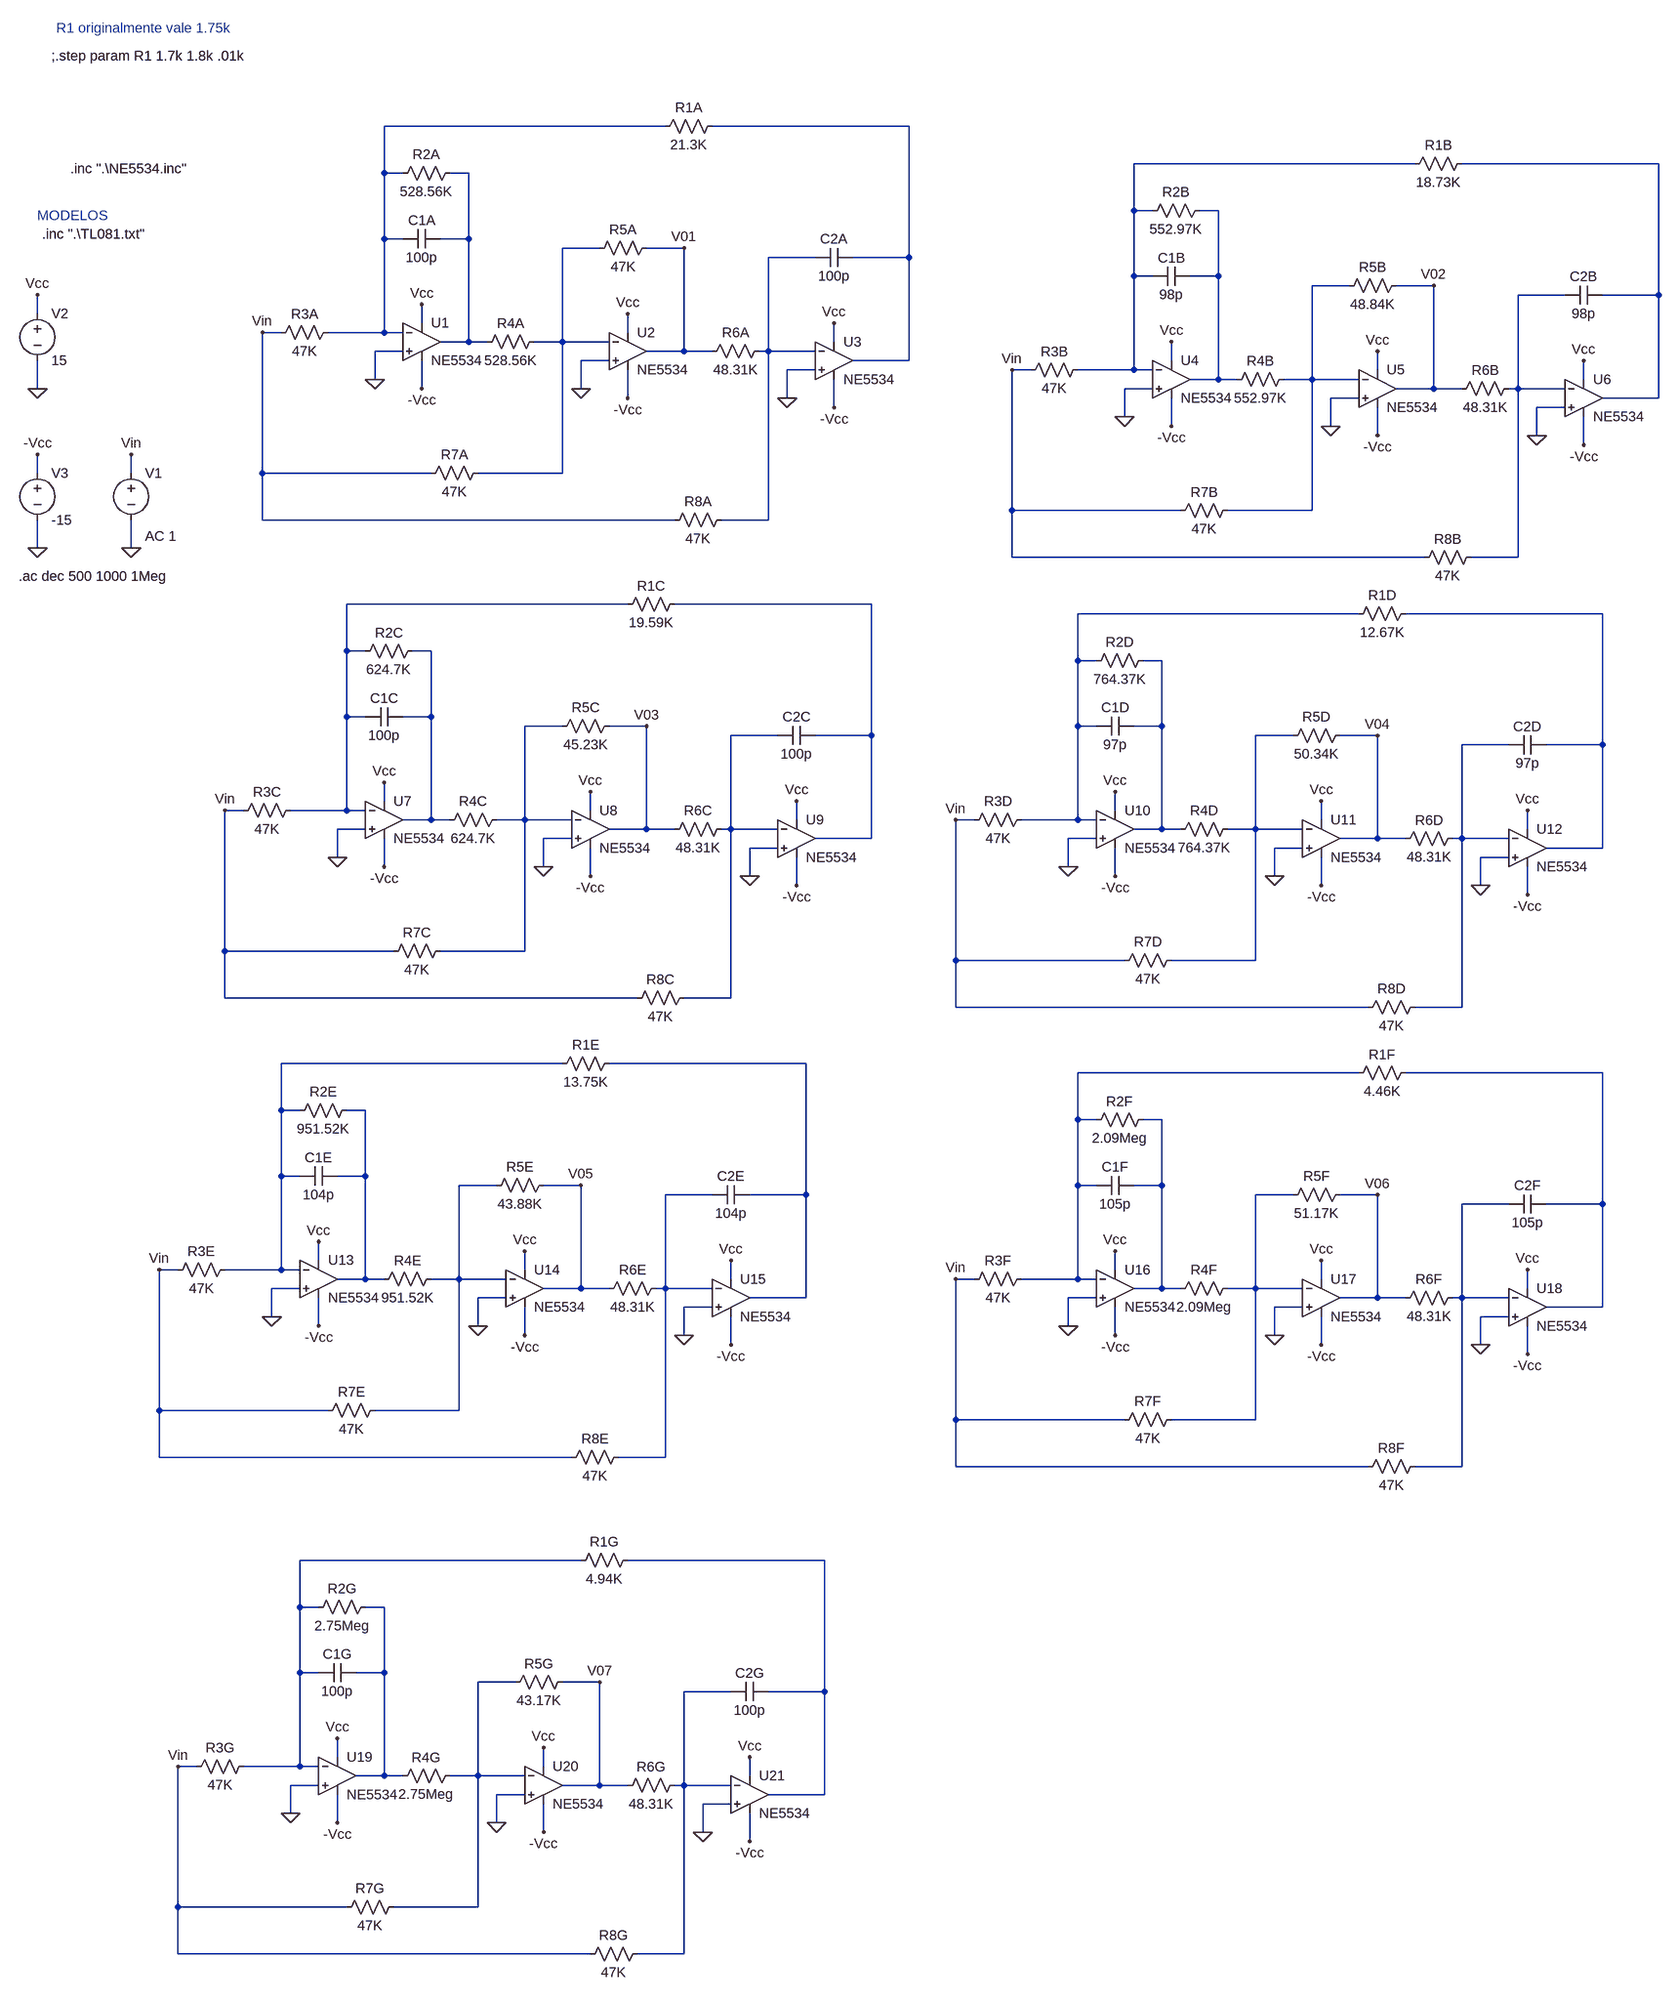
[diagram p0: schematic FT-TL081.asc]
FT-TL081.asc, the LTspice schematic file:
Version 4
SHEET 1 2736 2688
WIRE 800 -480 320 -480
WIRE 1216 -480 880 -480
WIRE 2080 -416 1600 -416
WIRE 2496 -416 2160 -416
WIRE 320 -400 320 -480
WIRE 352 -400 320 -400
WIRE 464 -400 432 -400
WIRE 1600 -336 1600 -416
WIRE 1632 -336 1600 -336
WIRE 1744 -336 1712 -336
WIRE 320 -288 320 -400
WIRE 352 -288 320 -288
WIRE 464 -288 464 -400
WIRE 464 -288 416 -288
WIRE 688 -272 624 -272
WIRE 832 -272 768 -272
WIRE 1056 -256 976 -256
WIRE 1216 -256 1216 -480
WIRE 1216 -256 1120 -256
WIRE 1600 -224 1600 -336
WIRE 1632 -224 1600 -224
WIRE 1744 -224 1744 -336
WIRE 1744 -224 1696 -224
WIRE 1968 -208 1904 -208
WIRE 2112 -208 2048 -208
WIRE 2336 -192 2256 -192
WIRE 2496 -192 2496 -416
WIRE 2496 -192 2400 -192
WIRE -272 -160 -272 -192
WIRE 384 -144 384 -176
WIRE 144 -128 112 -128
WIRE 320 -128 320 -288
WIRE 320 -128 224 -128
WIRE 352 -128 320 -128
WIRE 736 -128 736 -160
WIRE 464 -112 464 -288
WIRE 464 -112 416 -112
WIRE 496 -112 464 -112
WIRE 624 -112 624 -272
WIRE 624 -112 576 -112
WIRE 704 -112 624 -112
WIRE 1088 -112 1088 -144
WIRE 352 -96 304 -96
WIRE 832 -96 832 -272
WIRE 832 -96 768 -96
WIRE 880 -96 832 -96
WIRE 976 -96 976 -256
WIRE 976 -96 960 -96
WIRE 1056 -96 976 -96
WIRE 704 -80 656 -80
WIRE 1216 -80 1216 -256
WIRE 1216 -80 1120 -80
WIRE 1664 -80 1664 -112
WIRE 1056 -64 1008 -64
WIRE 1424 -64 1392 -64
WIRE 1600 -64 1600 -224
WIRE 1600 -64 1504 -64
WIRE 1632 -64 1600 -64
WIRE 2016 -64 2016 -96
WIRE 304 -48 304 -96
WIRE 1744 -48 1744 -224
WIRE 1744 -48 1696 -48
WIRE 1776 -48 1744 -48
WIRE 1904 -48 1904 -208
WIRE 1904 -48 1856 -48
WIRE 1984 -48 1904 -48
WIRE 2368 -48 2368 -80
WIRE -272 -32 -272 -80
WIRE 384 -32 384 -80
WIRE 656 -32 656 -80
WIRE 1632 -32 1584 -32
WIRE 2112 -32 2112 -208
WIRE 2112 -32 2048 -32
WIRE 2160 -32 2112 -32
WIRE 2256 -32 2256 -192
WIRE 2256 -32 2240 -32
WIRE 2336 -32 2256 -32
WIRE 736 -16 736 -64
WIRE 1008 -16 1008 -64
WIRE 1984 -16 1936 -16
WIRE 2496 -16 2496 -192
WIRE 2496 -16 2400 -16
WIRE 1088 0 1088 -48
WIRE 2336 0 2288 0
WIRE 1584 16 1584 -32
WIRE 1664 32 1664 -16
WIRE 1936 32 1936 -16
WIRE 2016 48 2016 0
WIRE 2288 48 2288 0
WIRE 2368 64 2368 16
WIRE -272 112 -272 80
WIRE -112 112 -112 80
WIRE 112 112 112 -128
WIRE 400 112 112 112
WIRE 624 112 624 -112
WIRE 624 112 480 112
WIRE 1392 176 1392 -64
WIRE 1680 176 1392 176
WIRE 1904 176 1904 -48
WIRE 1904 176 1760 176
WIRE 112 192 112 112
WIRE 816 192 112 192
WIRE 976 192 976 -96
WIRE 976 192 896 192
WIRE -272 240 -272 192
WIRE -112 240 -112 192
WIRE 1392 256 1392 176
WIRE 2096 256 1392 256
WIRE 2256 256 2256 -32
WIRE 2256 256 2176 256
WIRE 736 336 256 336
WIRE 1152 336 816 336
WIRE 1984 352 1504 352
WIRE 2400 352 2064 352
WIRE 256 416 256 336
WIRE 288 416 256 416
WIRE 400 416 368 416
WIRE 1504 432 1504 352
WIRE 1536 432 1504 432
WIRE 1648 432 1616 432
WIRE 256 528 256 416
WIRE 288 528 256 528
WIRE 400 528 400 416
WIRE 400 528 352 528
WIRE 624 544 560 544
WIRE 768 544 704 544
WIRE 1504 544 1504 432
WIRE 1536 544 1504 544
WIRE 1648 544 1648 432
WIRE 1648 544 1600 544
WIRE 992 560 912 560
WIRE 1152 560 1152 336
WIRE 1152 560 1056 560
WIRE 1872 560 1808 560
WIRE 2016 560 1952 560
WIRE 2240 576 2160 576
WIRE 2400 576 2400 352
WIRE 2400 576 2304 576
WIRE 320 672 320 640
WIRE 80 688 48 688
WIRE 256 688 256 528
WIRE 256 688 160 688
WIRE 288 688 256 688
WIRE 672 688 672 656
WIRE 1568 688 1568 656
WIRE 400 704 400 528
WIRE 400 704 352 704
WIRE 432 704 400 704
WIRE 560 704 560 544
WIRE 560 704 512 704
WIRE 640 704 560 704
WIRE 1024 704 1024 672
WIRE 1328 704 1296 704
WIRE 1504 704 1504 544
WIRE 1504 704 1408 704
WIRE 1536 704 1504 704
WIRE 1920 704 1920 672
WIRE 288 720 240 720
WIRE 768 720 768 544
WIRE 768 720 704 720
WIRE 816 720 768 720
WIRE 912 720 912 560
WIRE 912 720 896 720
WIRE 992 720 912 720
WIRE 1648 720 1648 544
WIRE 1648 720 1600 720
WIRE 1680 720 1648 720
WIRE 1808 720 1808 560
WIRE 1808 720 1760 720
WIRE 1888 720 1808 720
WIRE 2272 720 2272 688
WIRE 640 736 592 736
WIRE 1152 736 1152 560
WIRE 1152 736 1056 736
WIRE 1536 736 1488 736
WIRE 2016 736 2016 560
WIRE 2016 736 1952 736
WIRE 2064 736 2016 736
WIRE 2160 736 2160 576
WIRE 2160 736 2144 736
WIRE 2240 736 2160 736
WIRE 992 752 944 752
WIRE 1888 752 1840 752
WIRE 2400 752 2400 576
WIRE 2400 752 2304 752
WIRE 240 768 240 720
WIRE 2240 768 2192 768
WIRE 320 784 320 736
WIRE 592 784 592 736
WIRE 1488 784 1488 736
WIRE 672 800 672 752
WIRE 944 800 944 752
WIRE 1568 800 1568 752
WIRE 1840 800 1840 752
WIRE 1024 816 1024 768
WIRE 1920 816 1920 768
WIRE 2192 816 2192 768
WIRE 2272 832 2272 784
WIRE 48 928 48 688
WIRE 336 928 48 928
WIRE 560 928 560 704
WIRE 560 928 416 928
WIRE 1296 944 1296 704
WIRE 1584 944 1296 944
WIRE 1808 944 1808 720
WIRE 1808 944 1664 944
WIRE 48 1008 48 928
WIRE 752 1008 48 1008
WIRE 912 1008 912 720
WIRE 912 1008 832 1008
WIRE 1296 1024 1296 944
WIRE 2000 1024 1296 1024
WIRE 2160 1024 2160 736
WIRE 2160 1024 2080 1024
WIRE 624 1120 144 1120
WIRE 1040 1120 704 1120
WIRE 1984 1136 1504 1136
WIRE 2400 1136 2064 1136
WIRE 144 1200 144 1120
WIRE 176 1200 144 1200
WIRE 288 1200 256 1200
WIRE 1504 1216 1504 1136
WIRE 1536 1216 1504 1216
WIRE 1648 1216 1616 1216
WIRE 144 1312 144 1200
WIRE 176 1312 144 1312
WIRE 288 1312 288 1200
WIRE 288 1312 240 1312
WIRE 512 1328 448 1328
WIRE 656 1328 592 1328
WIRE 1504 1328 1504 1216
WIRE 1536 1328 1504 1328
WIRE 1648 1328 1648 1216
WIRE 1648 1328 1600 1328
WIRE 880 1344 800 1344
WIRE 1040 1344 1040 1120
WIRE 1040 1344 944 1344
WIRE 1872 1344 1808 1344
WIRE 2016 1344 1952 1344
WIRE 2240 1360 2160 1360
WIRE 2400 1360 2400 1136
WIRE 2400 1360 2304 1360
WIRE 208 1456 208 1424
WIRE -32 1472 -64 1472
WIRE 144 1472 144 1312
WIRE 144 1472 48 1472
WIRE 176 1472 144 1472
WIRE 560 1472 560 1440
WIRE 1568 1472 1568 1440
WIRE 288 1488 288 1312
WIRE 288 1488 240 1488
WIRE 320 1488 288 1488
WIRE 448 1488 448 1328
WIRE 448 1488 400 1488
WIRE 528 1488 448 1488
WIRE 912 1488 912 1456
WIRE 1328 1488 1296 1488
WIRE 1504 1488 1504 1328
WIRE 1504 1488 1408 1488
WIRE 1536 1488 1504 1488
WIRE 1920 1488 1920 1456
WIRE 176 1504 128 1504
WIRE 656 1504 656 1328
WIRE 656 1504 592 1504
WIRE 704 1504 656 1504
WIRE 800 1504 800 1344
WIRE 800 1504 784 1504
WIRE 880 1504 800 1504
WIRE 1648 1504 1648 1328
WIRE 1648 1504 1600 1504
WIRE 1680 1504 1648 1504
WIRE 1808 1504 1808 1344
WIRE 1808 1504 1760 1504
WIRE 1888 1504 1808 1504
WIRE 2272 1504 2272 1472
WIRE 528 1520 480 1520
WIRE 1040 1520 1040 1344
WIRE 1040 1520 944 1520
WIRE 1536 1520 1488 1520
WIRE 2016 1520 2016 1344
WIRE 2016 1520 1952 1520
WIRE 2064 1520 2016 1520
WIRE 2160 1520 2160 1360
WIRE 2160 1520 2144 1520
WIRE 2240 1520 2160 1520
WIRE 880 1536 832 1536
WIRE 1888 1536 1840 1536
WIRE 2400 1536 2400 1360
WIRE 2400 1536 2304 1536
WIRE 128 1552 128 1504
WIRE 2240 1552 2192 1552
WIRE 208 1568 208 1520
WIRE 480 1568 480 1520
WIRE 1488 1568 1488 1520
WIRE 560 1584 560 1536
WIRE 832 1584 832 1536
WIRE 1568 1584 1568 1536
WIRE 1840 1584 1840 1536
WIRE 912 1600 912 1552
WIRE 1920 1600 1920 1552
WIRE 2192 1600 2192 1552
WIRE 2272 1616 2272 1568
WIRE -64 1712 -64 1472
WIRE 224 1712 -64 1712
WIRE 448 1712 448 1488
WIRE 448 1712 304 1712
WIRE 1296 1728 1296 1488
WIRE 1584 1728 1296 1728
WIRE 1808 1728 1808 1504
WIRE 1808 1728 1664 1728
WIRE -64 1792 -64 1712
WIRE 640 1792 -64 1792
WIRE 800 1792 800 1504
WIRE 800 1792 720 1792
WIRE 1296 1808 1296 1728
WIRE 2000 1808 1296 1808
WIRE 2160 1808 2160 1520
WIRE 2160 1808 2080 1808
WIRE 656 1968 176 1968
WIRE 1072 1968 736 1968
WIRE 176 2048 176 1968
WIRE 208 2048 176 2048
WIRE 320 2048 288 2048
WIRE 176 2160 176 2048
WIRE 208 2160 176 2160
WIRE 320 2160 320 2048
WIRE 320 2160 272 2160
WIRE 544 2176 480 2176
WIRE 688 2176 624 2176
WIRE 912 2192 832 2192
WIRE 1072 2192 1072 1968
WIRE 1072 2192 976 2192
WIRE 240 2304 240 2272
WIRE 0 2320 -32 2320
WIRE 176 2320 176 2160
WIRE 176 2320 80 2320
WIRE 208 2320 176 2320
WIRE 592 2320 592 2288
WIRE 320 2336 320 2160
WIRE 320 2336 272 2336
WIRE 352 2336 320 2336
WIRE 480 2336 480 2176
WIRE 480 2336 432 2336
WIRE 560 2336 480 2336
WIRE 944 2336 944 2304
WIRE 208 2352 160 2352
WIRE 688 2352 688 2176
WIRE 688 2352 624 2352
WIRE 736 2352 688 2352
WIRE 832 2352 832 2192
WIRE 832 2352 816 2352
WIRE 912 2352 832 2352
WIRE 560 2368 512 2368
WIRE 1072 2368 1072 2192
WIRE 1072 2368 976 2368
WIRE 912 2384 864 2384
WIRE 160 2400 160 2352
WIRE 240 2416 240 2368
WIRE 512 2416 512 2368
WIRE 592 2432 592 2384
WIRE 864 2432 864 2384
WIRE 944 2448 944 2400
WIRE -32 2560 -32 2320
WIRE 256 2560 -32 2560
WIRE 480 2560 480 2336
WIRE 480 2560 336 2560
WIRE -32 2640 -32 2560
WIRE 672 2640 -32 2640
WIRE 832 2640 832 2352
WIRE 832 2640 752 2640
FLAG -272 80 -Vcc
FLAG -272 -192 Vcc
FLAG -272 -32 0
FLAG -272 240 0
FLAG 384 -176 Vcc
FLAG 384 -32 -Vcc
FLAG 304 -48 0
FLAG 736 -160 Vcc
FLAG 736 -16 -Vcc
FLAG 656 -32 0
FLAG 1088 -144 Vcc
FLAG 1088 0 -Vcc
FLAG 1008 -16 0
FLAG -112 240 0
FLAG -112 80 Vin
FLAG 112 -128 Vin
FLAG 832 -272 V01
FLAG 1664 -112 Vcc
FLAG 1664 32 -Vcc
FLAG 1584 16 0
FLAG 2016 -96 Vcc
FLAG 2016 48 -Vcc
FLAG 1936 32 0
FLAG 2368 -80 Vcc
FLAG 2368 64 -Vcc
FLAG 2288 48 0
FLAG 1392 -64 Vin
FLAG 2112 -208 V02
FLAG 320 640 Vcc
FLAG 320 784 -Vcc
FLAG 240 768 0
FLAG 672 656 Vcc
FLAG 672 800 -Vcc
FLAG 592 784 0
FLAG 1024 672 Vcc
FLAG 1024 816 -Vcc
FLAG 944 800 0
FLAG 48 688 Vin
FLAG 768 544 V03
FLAG 1568 656 Vcc
FLAG 1568 800 -Vcc
FLAG 1488 784 0
FLAG 1920 672 Vcc
FLAG 1920 816 -Vcc
FLAG 1840 800 0
FLAG 2272 688 Vcc
FLAG 2272 832 -Vcc
FLAG 2192 816 0
FLAG 1296 704 Vin
FLAG 2016 560 V04
FLAG 208 1424 Vcc
FLAG 208 1568 -Vcc
FLAG 128 1552 0
FLAG 560 1440 Vcc
FLAG 560 1584 -Vcc
FLAG 480 1568 0
FLAG 912 1456 Vcc
FLAG 912 1600 -Vcc
FLAG 832 1584 0
FLAG -64 1472 Vin
FLAG 656 1328 V05
FLAG 1568 1440 Vcc
FLAG 1568 1584 -Vcc
FLAG 1488 1568 0
FLAG 1920 1456 Vcc
FLAG 1920 1600 -Vcc
FLAG 1840 1584 0
FLAG 2272 1472 Vcc
FLAG 2272 1616 -Vcc
FLAG 2192 1600 0
FLAG 1296 1488 Vin
FLAG 2016 1344 V06
FLAG 240 2272 Vcc
FLAG 240 2416 -Vcc
FLAG 160 2400 0
FLAG 592 2288 Vcc
FLAG 592 2432 -Vcc
FLAG 512 2416 0
FLAG 944 2304 Vcc
FLAG 944 2448 -Vcc
FLAG 864 2432 0
FLAG -32 2320 Vin
FLAG 688 2176 V07
SYMBOL voltage -272 -176 R0
SYMATTR InstName V2
SYMATTR Value 15
SYMBOL voltage -272 96 R0
SYMATTR InstName V3
SYMATTR Value -15
SYMBOL Opamps\\opamp2 384 -176 R0
SYMATTR InstName U1
SYMATTR Value NE5534
SYMBOL cap 416 -304 R90
WINDOW 0 0 32 VBottom 2
WINDOW 3 32 32 VTop 2
SYMATTR InstName C1A
SYMATTR Value 100p
SYMBOL res 896 -496 R90
WINDOW 0 0 56 VBottom 2
WINDOW 3 32 56 VTop 2
SYMATTR InstName R1A
SYMATTR Value 21.3K
SYMBOL res 448 -416 R90
WINDOW 0 0 56 VBottom 2
WINDOW 3 32 56 VTop 2
SYMATTR InstName R2A
SYMATTR Value 528.56K
SYMBOL res 240 -144 R90
WINDOW 0 0 56 VBottom 2
WINDOW 3 32 56 VTop 2
SYMATTR InstName R3A
SYMATTR Value 47K
SYMBOL res 592 -128 R90
WINDOW 0 0 56 VBottom 2
WINDOW 3 32 56 VTop 2
SYMATTR InstName R4A
SYMATTR Value 528.56K
SYMBOL res 784 -288 R90
WINDOW 0 0 56 VBottom 2
WINDOW 3 32 56 VTop 2
SYMATTR InstName R5A
SYMATTR Value 47K
SYMBOL res 976 -112 R90
WINDOW 0 0 56 VBottom 2
WINDOW 3 32 56 VTop 2
SYMATTR InstName R6A
SYMATTR Value 48.31K
SYMBOL res 496 96 R90
WINDOW 0 0 56 VBottom 2
WINDOW 3 32 56 VTop 2
SYMATTR InstName R7A
SYMATTR Value 47K
SYMBOL res 912 176 R90
WINDOW 0 0 56 VBottom 2
WINDOW 3 32 56 VTop 2
SYMATTR InstName R8A
SYMATTR Value 47K
SYMBOL cap 1120 -272 R90
WINDOW 0 0 32 VBottom 2
WINDOW 3 32 32 VTop 2
SYMATTR InstName C2A
SYMATTR Value 100p
SYMBOL voltage -112 96 R0
WINDOW 123 24 124 Left 2
WINDOW 39 0 0 Left 0
SYMATTR Value2 AC 1
SYMATTR InstName V1
SYMATTR Value ""
SYMBOL Opamps\\opamp2 736 -160 R0
SYMATTR InstName U2
SYMATTR Value NE5534
SYMBOL Opamps\\opamp2 1088 -144 R0
SYMATTR InstName U3
SYMATTR Value NE5534
SYMBOL Opamps\\opamp2 1664 -112 R0
SYMATTR InstName U4
SYMATTR Value NE5534
SYMBOL cap 1696 -240 R90
WINDOW 0 0 32 VBottom 2
WINDOW 3 32 32 VTop 2
SYMATTR InstName C1B
SYMATTR Value 98p
SYMBOL res 2176 -432 R90
WINDOW 0 0 56 VBottom 2
WINDOW 3 32 56 VTop 2
SYMATTR InstName R1B
SYMATTR Value 18.73K
SYMBOL res 1728 -352 R90
WINDOW 0 0 56 VBottom 2
WINDOW 3 32 56 VTop 2
SYMATTR InstName R2B
SYMATTR Value 552.97K
SYMBOL res 1520 -80 R90
WINDOW 0 0 56 VBottom 2
WINDOW 3 32 56 VTop 2
SYMATTR InstName R3B
SYMATTR Value 47K
SYMBOL res 1872 -64 R90
WINDOW 0 0 56 VBottom 2
WINDOW 3 32 56 VTop 2
SYMATTR InstName R4B
SYMATTR Value 552.97K
SYMBOL res 2064 -224 R90
WINDOW 0 0 56 VBottom 2
WINDOW 3 32 56 VTop 2
SYMATTR InstName R5B
SYMATTR Value 48.84K
SYMBOL res 2256 -48 R90
WINDOW 0 0 56 VBottom 2
WINDOW 3 32 56 VTop 2
SYMATTR InstName R6B
SYMATTR Value 48.31K
SYMBOL res 1776 160 R90
WINDOW 0 0 56 VBottom 2
WINDOW 3 32 56 VTop 2
SYMATTR InstName R7B
SYMATTR Value 47K
SYMBOL res 2192 240 R90
WINDOW 0 0 56 VBottom 2
WINDOW 3 32 56 VTop 2
SYMATTR InstName R8B
SYMATTR Value 47K
SYMBOL cap 2400 -208 R90
WINDOW 0 0 32 VBottom 2
WINDOW 3 32 32 VTop 2
SYMATTR InstName C2B
SYMATTR Value 98p
SYMBOL Opamps\\opamp2 2016 -96 R0
SYMATTR InstName U5
SYMATTR Value NE5534
SYMBOL Opamps\\opamp2 2368 -80 R0
SYMATTR InstName U6
SYMATTR Value NE5534
SYMBOL Opamps\\opamp2 320 640 R0
SYMATTR InstName U7
SYMATTR Value NE5534
SYMBOL cap 352 512 R90
WINDOW 0 0 32 VBottom 2
WINDOW 3 32 32 VTop 2
SYMATTR InstName C1C
SYMATTR Value 100p
SYMBOL res 832 320 R90
WINDOW 0 0 56 VBottom 2
WINDOW 3 32 56 VTop 2
SYMATTR InstName R1C
SYMATTR Value 19.59K
SYMBOL res 384 400 R90
WINDOW 0 0 56 VBottom 2
WINDOW 3 32 56 VTop 2
SYMATTR InstName R2C
SYMATTR Value 624.7K
SYMBOL res 176 672 R90
WINDOW 0 0 56 VBottom 2
WINDOW 3 32 56 VTop 2
SYMATTR InstName R3C
SYMATTR Value 47K
SYMBOL res 528 688 R90
WINDOW 0 0 56 VBottom 2
WINDOW 3 32 56 VTop 2
SYMATTR InstName R4C
SYMATTR Value 624.7K
SYMBOL res 720 528 R90
WINDOW 0 0 56 VBottom 2
WINDOW 3 32 56 VTop 2
SYMATTR InstName R5C
SYMATTR Value 45.23K
SYMBOL res 912 704 R90
WINDOW 0 0 56 VBottom 2
WINDOW 3 32 56 VTop 2
SYMATTR InstName R6C
SYMATTR Value 48.31K
SYMBOL res 432 912 R90
WINDOW 0 0 56 VBottom 2
WINDOW 3 32 56 VTop 2
SYMATTR InstName R7C
SYMATTR Value 47K
SYMBOL res 848 992 R90
WINDOW 0 0 56 VBottom 2
WINDOW 3 32 56 VTop 2
SYMATTR InstName R8C
SYMATTR Value 47K
SYMBOL cap 1056 544 R90
WINDOW 0 0 32 VBottom 2
WINDOW 3 32 32 VTop 2
SYMATTR InstName C2C
SYMATTR Value 100p
SYMBOL Opamps\\opamp2 672 656 R0
SYMATTR InstName U8
SYMATTR Value NE5534
SYMBOL Opamps\\opamp2 1024 672 R0
SYMATTR InstName U9
SYMATTR Value NE5534
SYMBOL Opamps\\opamp2 1568 656 R0
SYMATTR InstName U10
SYMATTR Value NE5534
SYMBOL cap 1600 528 R90
WINDOW 0 0 32 VBottom 2
WINDOW 3 32 32 VTop 2
SYMATTR InstName C1D
SYMATTR Value 97p
SYMBOL res 2080 336 R90
WINDOW 0 0 56 VBottom 2
WINDOW 3 32 56 VTop 2
SYMATTR InstName R1D
SYMATTR Value 12.67K
SYMBOL res 1632 416 R90
WINDOW 0 0 56 VBottom 2
WINDOW 3 32 56 VTop 2
SYMATTR InstName R2D
SYMATTR Value 764.37K
SYMBOL res 1424 688 R90
WINDOW 0 0 56 VBottom 2
WINDOW 3 32 56 VTop 2
SYMATTR InstName R3D
SYMATTR Value 47K
SYMBOL res 1776 704 R90
WINDOW 0 0 56 VBottom 2
WINDOW 3 32 56 VTop 2
SYMATTR InstName R4D
SYMATTR Value 764.37K
SYMBOL res 1968 544 R90
WINDOW 0 0 56 VBottom 2
WINDOW 3 32 56 VTop 2
SYMATTR InstName R5D
SYMATTR Value 50.34K
SYMBOL res 2160 720 R90
WINDOW 0 0 56 VBottom 2
WINDOW 3 32 56 VTop 2
SYMATTR InstName R6D
SYMATTR Value 48.31K
SYMBOL res 1680 928 R90
WINDOW 0 0 56 VBottom 2
WINDOW 3 32 56 VTop 2
SYMATTR InstName R7D
SYMATTR Value 47K
SYMBOL res 2096 1008 R90
WINDOW 0 0 56 VBottom 2
WINDOW 3 32 56 VTop 2
SYMATTR InstName R8D
SYMATTR Value 47K
SYMBOL cap 2304 560 R90
WINDOW 0 0 32 VBottom 2
WINDOW 3 32 32 VTop 2
SYMATTR InstName C2D
SYMATTR Value 97p
SYMBOL Opamps\\opamp2 1920 672 R0
SYMATTR InstName U11
SYMATTR Value NE5534
SYMBOL Opamps\\opamp2 2272 688 R0
SYMATTR InstName U12
SYMATTR Value NE5534
SYMBOL Opamps\\opamp2 208 1424 R0
SYMATTR InstName U13
SYMATTR Value NE5534
SYMBOL cap 240 1296 R90
WINDOW 0 0 32 VBottom 2
WINDOW 3 32 32 VTop 2
SYMATTR InstName C1E
SYMATTR Value 104p
SYMBOL res 720 1104 R90
WINDOW 0 0 56 VBottom 2
WINDOW 3 32 56 VTop 2
SYMATTR InstName R1E
SYMATTR Value 13.75K
SYMBOL res 272 1184 R90
WINDOW 0 0 56 VBottom 2
WINDOW 3 32 56 VTop 2
SYMATTR InstName R2E
SYMATTR Value 951.52K
SYMBOL res 64 1456 R90
WINDOW 0 0 56 VBottom 2
WINDOW 3 32 56 VTop 2
SYMATTR InstName R3E
SYMATTR Value 47K
SYMBOL res 416 1472 R90
WINDOW 0 0 56 VBottom 2
WINDOW 3 32 56 VTop 2
SYMATTR InstName R4E
SYMATTR Value 951.52K
SYMBOL res 608 1312 R90
WINDOW 0 0 56 VBottom 2
WINDOW 3 32 56 VTop 2
SYMATTR InstName R5E
SYMATTR Value 43.88K
SYMBOL res 800 1488 R90
WINDOW 0 0 56 VBottom 2
WINDOW 3 32 56 VTop 2
SYMATTR InstName R6E
SYMATTR Value 48.31K
SYMBOL res 320 1696 R90
WINDOW 0 0 56 VBottom 2
WINDOW 3 32 56 VTop 2
SYMATTR InstName R7E
SYMATTR Value 47K
SYMBOL res 736 1776 R90
WINDOW 0 0 56 VBottom 2
WINDOW 3 32 56 VTop 2
SYMATTR InstName R8E
SYMATTR Value 47K
SYMBOL cap 944 1328 R90
WINDOW 0 0 32 VBottom 2
WINDOW 3 32 32 VTop 2
SYMATTR InstName C2E
SYMATTR Value 104p
SYMBOL Opamps\\opamp2 560 1440 R0
SYMATTR InstName U14
SYMATTR Value NE5534
SYMBOL Opamps\\opamp2 912 1456 R0
SYMATTR InstName U15
SYMATTR Value NE5534
SYMBOL Opamps\\opamp2 1568 1440 R0
SYMATTR InstName U16
SYMATTR Value NE5534
SYMBOL cap 1600 1312 R90
WINDOW 0 0 32 VBottom 2
WINDOW 3 32 32 VTop 2
SYMATTR InstName C1F
SYMATTR Value 105p
SYMBOL res 2080 1120 R90
WINDOW 0 0 56 VBottom 2
WINDOW 3 32 56 VTop 2
SYMATTR InstName R1F
SYMATTR Value 4.46K
SYMBOL res 1632 1200 R90
WINDOW 0 0 56 VBottom 2
WINDOW 3 32 56 VTop 2
SYMATTR InstName R2F
SYMATTR Value 2.09Meg
SYMBOL res 1424 1472 R90
WINDOW 0 0 56 VBottom 2
WINDOW 3 32 56 VTop 2
SYMATTR InstName R3F
SYMATTR Value 47K
SYMBOL res 1776 1488 R90
WINDOW 0 0 56 VBottom 2
WINDOW 3 32 56 VTop 2
SYMATTR InstName R4F
SYMATTR Value 2.09Meg
SYMBOL res 1968 1328 R90
WINDOW 0 0 56 VBottom 2
WINDOW 3 32 56 VTop 2
SYMATTR InstName R5F
SYMATTR Value 51.17K
SYMBOL res 2160 1504 R90
WINDOW 0 0 56 VBottom 2
WINDOW 3 32 56 VTop 2
SYMATTR InstName R6F
SYMATTR Value 48.31K
SYMBOL res 1680 1712 R90
WINDOW 0 0 56 VBottom 2
WINDOW 3 32 56 VTop 2
SYMATTR InstName R7F
SYMATTR Value 47K
SYMBOL res 2096 1792 R90
WINDOW 0 0 56 VBottom 2
WINDOW 3 32 56 VTop 2
SYMATTR InstName R8F
SYMATTR Value 47K
SYMBOL cap 2304 1344 R90
WINDOW 0 0 32 VBottom 2
WINDOW 3 32 32 VTop 2
SYMATTR InstName C2F
SYMATTR Value 105p
SYMBOL Opamps\\opamp2 1920 1456 R0
SYMATTR InstName U17
SYMATTR Value NE5534
SYMBOL Opamps\\opamp2 2272 1472 R0
SYMATTR InstName U18
SYMATTR Value NE5534
SYMBOL Opamps\\opamp2 240 2272 R0
SYMATTR InstName U19
SYMATTR Value NE5534
SYMBOL cap 272 2144 R90
WINDOW 0 0 32 VBottom 2
WINDOW 3 32 32 VTop 2
SYMATTR InstName C1G
SYMATTR Value 100p
SYMBOL res 752 1952 R90
WINDOW 0 0 56 VBottom 2
WINDOW 3 32 56 VTop 2
SYMATTR InstName R1G
SYMATTR Value 4.94K
SYMBOL res 304 2032 R90
WINDOW 0 0 56 VBottom 2
WINDOW 3 32 56 VTop 2
SYMATTR InstName R2G
SYMATTR Value 2.75Meg
SYMBOL res 96 2304 R90
WINDOW 0 0 56 VBottom 2
WINDOW 3 32 56 VTop 2
SYMATTR InstName R3G
SYMATTR Value 47K
SYMBOL res 448 2320 R90
WINDOW 0 0 56 VBottom 2
WINDOW 3 32 56 VTop 2
SYMATTR InstName R4G
SYMATTR Value 2.75Meg
SYMBOL res 640 2160 R90
WINDOW 0 0 56 VBottom 2
WINDOW 3 32 56 VTop 2
SYMATTR InstName R5G
SYMATTR Value 43.17K
SYMBOL res 832 2336 R90
WINDOW 0 0 56 VBottom 2
WINDOW 3 32 56 VTop 2
SYMATTR InstName R6G
SYMATTR Value 48.31K
SYMBOL res 352 2544 R90
WINDOW 0 0 56 VBottom 2
WINDOW 3 32 56 VTop 2
SYMATTR InstName R7G
SYMATTR Value 47K
SYMBOL res 768 2624 R90
WINDOW 0 0 56 VBottom 2
WINDOW 3 32 56 VTop 2
SYMATTR InstName R8G
SYMATTR Value 47K
SYMBOL cap 976 2176 R90
WINDOW 0 0 32 VBottom 2
WINDOW 3 32 32 VTop 2
SYMATTR InstName C2G
SYMATTR Value 100p
SYMBOL Opamps\\opamp2 592 2288 R0
SYMATTR InstName U20
SYMATTR Value NE5534
SYMBOL Opamps\\opamp2 944 2304 R0
SYMATTR InstName U21
SYMATTR Value NE5534
TEXT -264 -296 Left 2 !.inc ".\\TL081.txt"
TEXT -272 -328 Left 2 ;MODELOS
TEXT -248 -600 Left 2 !;.step param R1 1.7k 1.8k .01k
TEXT -240 -648 Left 2 ;R1 originalmente vale 1.75k
TEXT -304 288 Left 2 !.ac dec 500 1000 1Meg
TEXT -216 -408 Left 2 !.inc ".\\NE5534.inc"

The netlist it stands for:
* FT-TL081.asc
V2 Vcc 0 15
V3 -Vcc 0 -15
XU1 0 N001 Vcc -Vcc N005 NE5534  ; pins In+ In- V+ V- OUT
C1A N005 N001 100p
R1A N002 N001 21.3K
R2A N005 N001 528.56K
R3A N001 Vin 47K
R4A N007 N005 528.56K
R5A V01 N007 47K
R6A N008 V01 48.31K
R7A N007 Vin 47K
R8A N008 Vin 47K
C2A N002 N008 100p
V1 Vin 0 AC 1
XU2 0 N007 Vcc -Vcc V01 NE5534  ; pins In+ In- V+ V- OUT
XU3 0 N008 Vcc -Vcc N002 NE5534  ; pins In+ In- V+ V- OUT
XU4 0 N003 Vcc -Vcc N006 NE5534  ; pins In+ In- V+ V- OUT
C1B N006 N003 98p
R1B N004 N003 18.73K
R2B N006 N003 552.97K
R3B N003 Vin 47K
R4B N009 N006 552.97K
R5B V02 N009 48.84K
R6B N010 V02 48.31K
R7B N009 Vin 47K
R8B N010 Vin 47K
C2B N004 N010 98p
XU5 0 N009 Vcc -Vcc V02 NE5534  ; pins In+ In- V+ V- OUT
XU6 0 N010 Vcc -Vcc N004 NE5534  ; pins In+ In- V+ V- OUT
XU7 0 N011 Vcc -Vcc N015 NE5534  ; pins In+ In- V+ V- OUT
C1C N015 N011 100p
R1C N012 N011 19.59K
R2C N015 N011 624.7K
R3C N011 Vin 47K
R4C N017 N015 624.7K
R5C V03 N017 45.23K
R6C N018 V03 48.31K
R7C N017 Vin 47K
R8C N018 Vin 47K
C2C N012 N018 100p
XU8 0 N017 Vcc -Vcc V03 NE5534  ; pins In+ In- V+ V- OUT
XU9 0 N018 Vcc -Vcc N012 NE5534  ; pins In+ In- V+ V- OUT
XU10 0 N013 Vcc -Vcc N016 NE5534  ; pins In+ In- V+ V- OUT
C1D N016 N013 97p
R1D N014 N013 12.67K
R2D N016 N013 764.37K
R3D N013 Vin 47K
R4D N019 N016 764.37K
R5D V04 N019 50.34K
R6D N020 V04 48.31K
R7D N019 Vin 47K
R8D N020 Vin 47K
C2D N014 N020 97p
XU11 0 N019 Vcc -Vcc V04 NE5534  ; pins In+ In- V+ V- OUT
XU12 0 N020 Vcc -Vcc N014 NE5534  ; pins In+ In- V+ V- OUT
XU13 0 N021 Vcc -Vcc N025 NE5534  ; pins In+ In- V+ V- OUT
C1E N025 N021 104p
R1E N022 N021 13.75K
R2E N025 N021 951.52K
R3E N021 Vin 47K
R4E N027 N025 951.52K
R5E V05 N027 43.88K
R6E N028 V05 48.31K
R7E N027 Vin 47K
R8E N028 Vin 47K
C2E N022 N028 104p
XU14 0 N027 Vcc -Vcc V05 NE5534  ; pins In+ In- V+ V- OUT
XU15 0 N028 Vcc -Vcc N022 NE5534  ; pins In+ In- V+ V- OUT
XU16 0 N023 Vcc -Vcc N026 NE5534  ; pins In+ In- V+ V- OUT
C1F N026 N023 105p
R1F N024 N023 4.46K
R2F N026 N023 2.09Meg
R3F N023 Vin 47K
R4F N029 N026 2.09Meg
R5F V06 N029 51.17K
R6F N030 V06 48.31K
R7F N029 Vin 47K
R8F N030 Vin 47K
C2F N024 N030 105p
XU17 0 N029 Vcc -Vcc V06 NE5534  ; pins In+ In- V+ V- OUT
XU18 0 N030 Vcc -Vcc N024 NE5534  ; pins In+ In- V+ V- OUT
XU19 0 N031 Vcc -Vcc N033 NE5534  ; pins In+ In- V+ V- OUT
C1G N033 N031 100p
R1G N032 N031 4.94K
R2G N033 N031 2.75Meg
R3G N031 Vin 47K
R4G N034 N033 2.75Meg
R5G V07 N034 43.17K
R6G N035 V07 48.31K
R7G N034 Vin 47K
R8G N035 Vin 47K
C2G N032 N035 100p
XU20 0 N034 Vcc -Vcc V07 NE5534  ; pins In+ In- V+ V- OUT
XU21 0 N035 Vcc -Vcc N032 NE5534  ; pins In+ In- V+ V- OUT
.inc ".\TL081.txt"
* MODELOS
;.step param R1 1.7k 1.8k .01k
* R1 originalmente vale 1.75k
.ac dec 500 1000 1Meg
.inc ".\NE5534.inc"
.backanno
.end